# EAGLE board Stromlaufplan_3D-Drucker-Dominik_und_Sami_v5 (EAGLE 9.5.2)
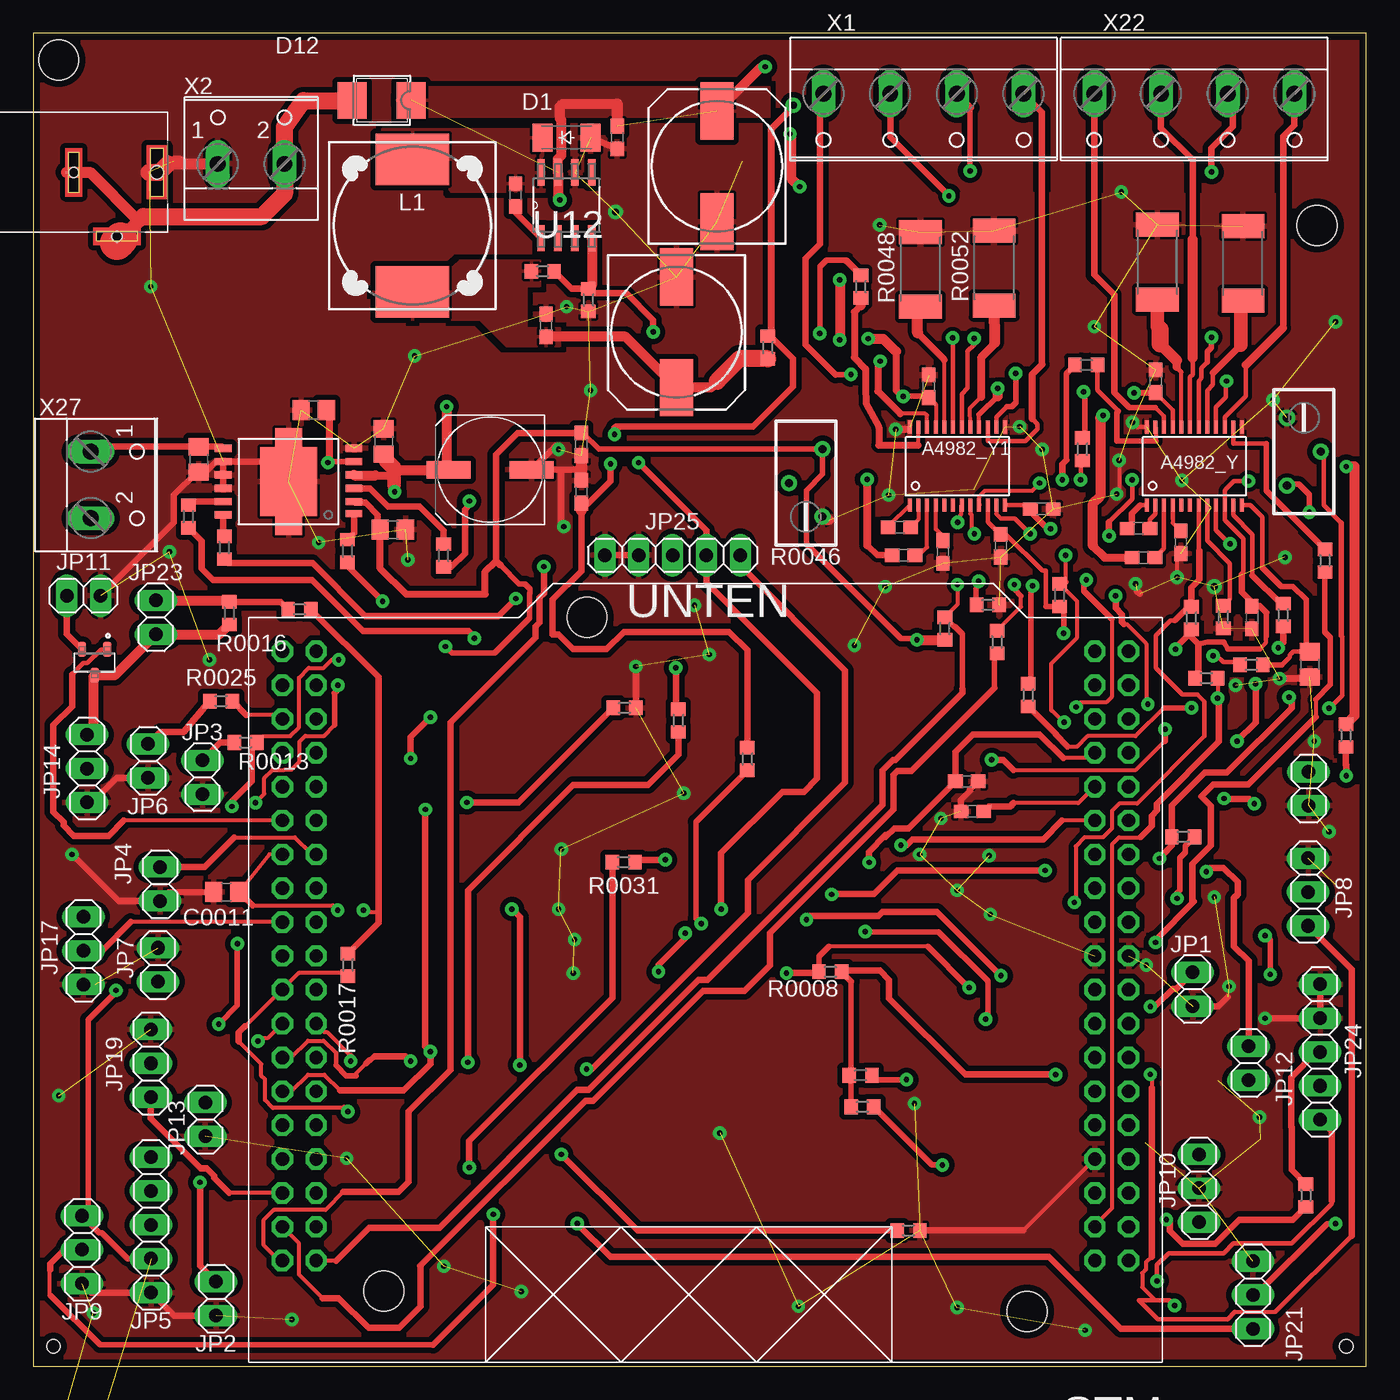
[diagram p5: board, top side]
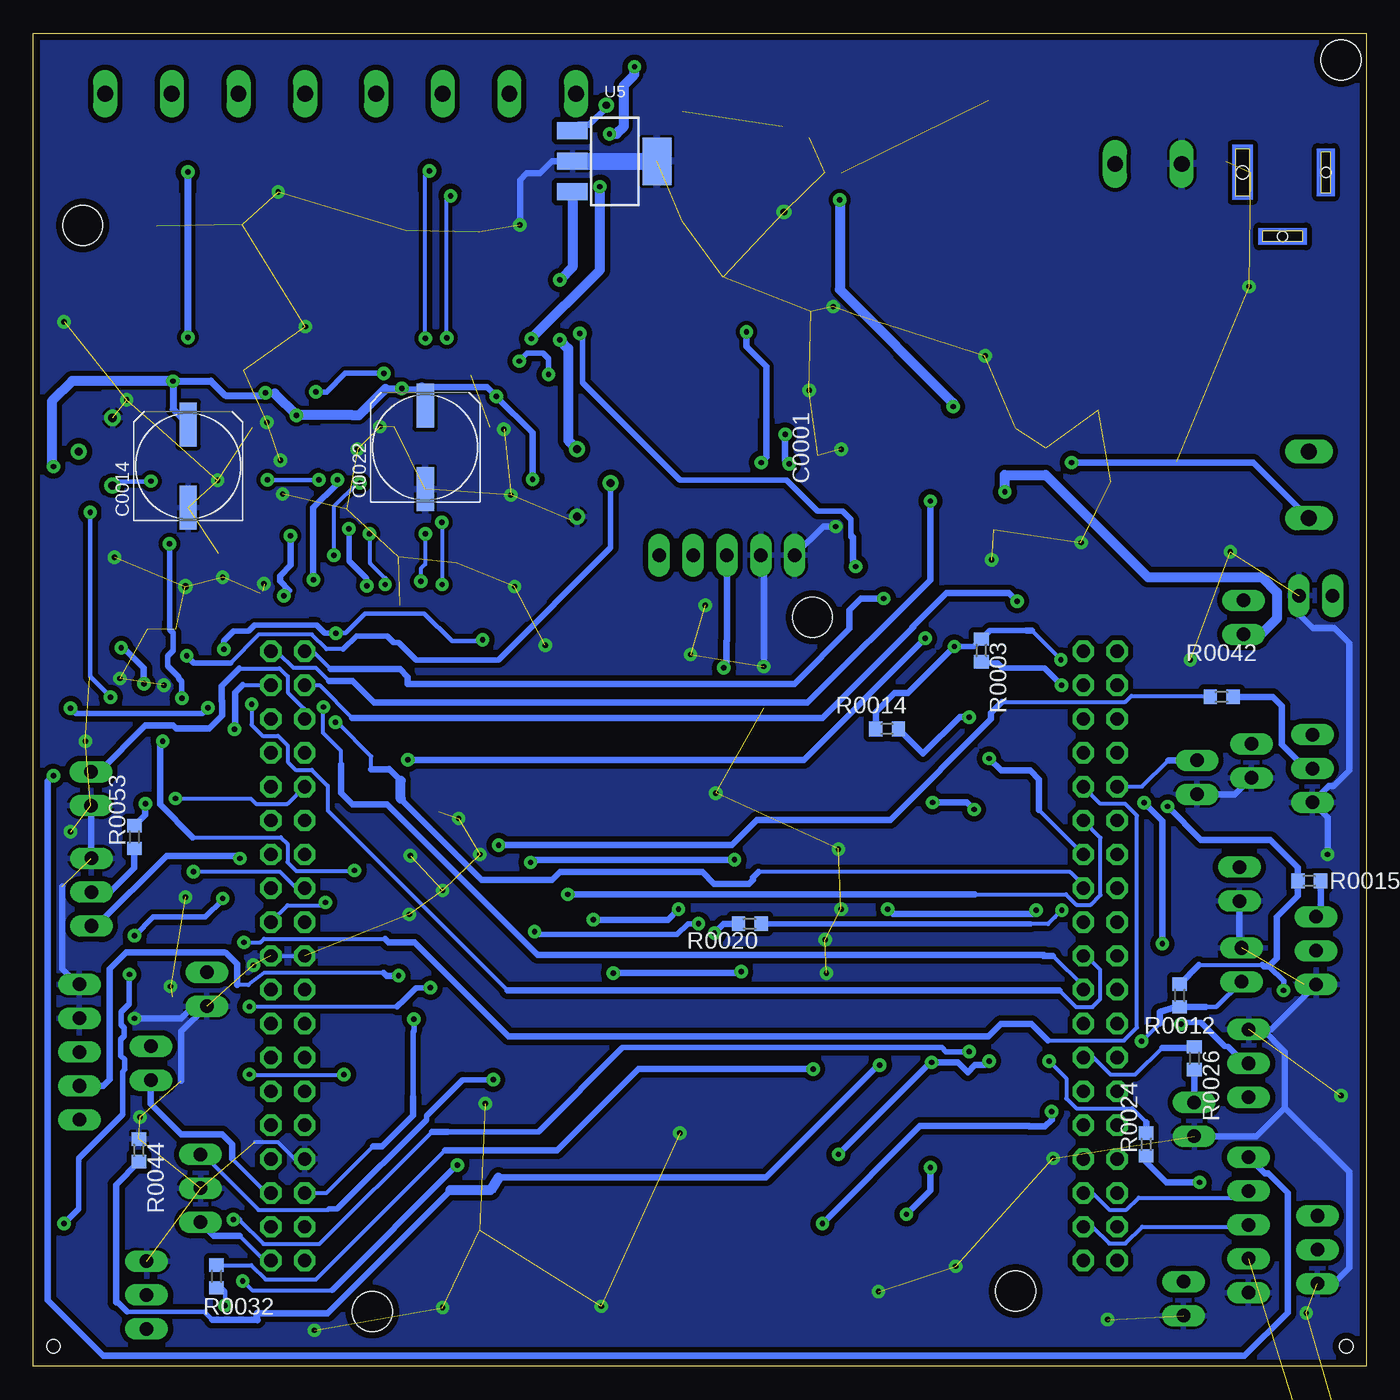
[diagram p6: board, bottom side, seen from below]

Size 100 x 100 mm. Coordinates in mm from the lower left corner, seen from the top.
Outline: 0,0 100,0 100,100 0,100 0,0
Copper layers (1*16): Top 0.035mm / dielectric 1.5mm / Bottom 0.035mm
Design rules "191010_FVM_default": minimum track width 0.3mm, minimum drill 0.4mm, track to track 0.3mm, track to pad 0.3mm, pad to pad 0.3mm, via to via 0.3mm, smd to smd 0.15mm, copper to edge 0.5mm, drill to drill 0.2mm, minimum pad ring 0.3mm, minimum via ring 0.3mm, stop-mask expansion 0.075mm, vias tented up to drill 0mil, thermal gap 0.2mm
Net classes: 0 default: width 0.3 mm, drill 0.4 mm, clearance 0.3 mm; 1 Ground: width 0.3 mm; 2 12V: width 0.3 mm; 3 5V: width 0.3 mm; 4 3,3V: width 0.3 mm
Holes 3 mm at 1.9,98 96.3,85.6
Holes 1 mm at 98.5,1.5 1.5,1.5

## Footprints (pad centres in the part's own frame; a part is rotated, then mirrored left to right if it is on the bottom)
TSSOP24 = smd 0.305 x 0.991: 1 -3.575,-2.918; 2 -2.925,-2.918; 3 -2.275,-2.918; 4 -1.625,-2.918; 5 -0.975,-2.918; 6 -0.325,-2.918; 7 0.325,-2.918; 8 0.975,-2.918; 9 1.625,-2.918; 10 2.275,-2.918; 11 2.925,-2.918; 12 3.575,-2.918; 13 3.575,2.918; 14 2.925,2.918; 15 2.275,2.918; 16 1.625,2.918; 17 0.975,2.918; 18 0.325,2.918; 19 -0.325,2.918; 20 -0.975,2.918; 21 -1.625,2.918; 22 -2.275,2.918; 23 -2.925,2.918; 24 -3.575,2.918
C0603 = smd 1.1 x 1: 1 -0.85,0; 2 0.85,0
C0805 = smd 1.3 x 1.5: 1 -0.95,0; 2 0.95,0
UD-8X10_NICHICON = smd 3.3 x 1.3: + 3.125,0; - -3.125,0
140CLH-1010 = smd 4.3 x 2.5: + 4.15,0; - -4.15,0
SOD-123_MINI-SMA = smd 1.5 x 2.1: A 1.8,0; C -1.8,0
SMB = smd 2.159 x 2.743: 1 -2.311,-0.127; 2 2.108,-0.102
BSOP-12 = smd 1.27 x 0.55: 1 -4.9,2.4; 2 -4.9,1.5; 3 -4.9,0.5; 4 -4.9,-0.5; 5 -4.9,-1.5; 6 -4.9,-2.5; 7 4.9,-2.5; 8 4.9,-1.5; 9 4.9,-0.5; 10 4.9,0.5; 11 4.9,1.5; 12 4.9,2.5 | smd 2 x 8: PAD 0,0 | smd 4.3 x 5.2: PAD2 0,0
SWC_RAPC712X = smd 0.1 x 0.1: 1 0,2.4; 2 5.3,0; 3 0,-3.8 | hole 1.01: 0,3 | hole 0.76: 0,-3.25; 4.8,0
1X02 = drill 1.016 long: 1 -1.27,0; 2 1.27,0
1X05 = drill 1.016 long: 1 -5.08,0; 2 -2.54,0; 3 0,0; 4 2.54,0; 5 5.08,0
1X03 = drill 1.016 long: 1 -2.54,0; 2 0,0; 3 2.54,0
INDUCTOR = smd 3.85 x 5.5: 1 -4.975,0; 2 4.975,0
SOT23-3 = smd 0.62 x 1.1: 1 -0.95,-0.975; 2 0.95,-0.975; 3 0,0.975
R0603 = smd 1 x 1.1: 1 -0.85,0; 2 0.85,0
RTRIM3296Y = drill 0.61: 1 1.27,-2.54; 2 -1.27,0; 3 1.27,2.54
R2512 = smd 1.8 x 3.2: 1 -2.8,0; 2 2.8,0
DIL40 = drill 1 octagon: L1 0,-63.5; L2 0,-60.96; L3 2.54,-63.5; L4 2.54,-60.96; L5 5.08,-63.5; L6 5.08,-60.96; L7 7.62,-63.5; L8 7.62,-60.96; L9 10.16,-63.5; L10 10.16,-60.96; L11 12.7,-63.5; L12 12.7,-60.96; L13 15.24,-63.5; L14 15.24,-60.96; L15 17.78,-63.5; L16 17.78,-60.96; L17 20.32,-63.5; L18 20.32,-60.96; L19 22.86,-63.5; L20 22.86,-60.96; L21 25.4,-63.5; L22 25.4,-60.96; L23 27.94,-63.5; L24 27.94,-60.96; L25 30.48,-63.5; L26 30.48,-60.96; L27 33.02,-63.5; L28 33.02,-60.96; L29 35.56,-63.5; L30 35.56,-60.96; L31 38.1,-63.5; L32 38.1,-60.96; L33 40.64,-63.5; L34 40.64,-60.96; L35 43.18,-63.5; L36 43.18,-60.96; L37 45.72,-63.5; L38 45.72,-60.96; R1 0,-2.54; R2 0,0; R3 2.54,-2.54; R4 2.54,0; R5 5.08,-2.54; R6 5.08,0; R7 7.62,-2.54; R8 7.62,0; R9 10.16,-2.54; R10 10.16,0; R11 12.7,-2.54; R12 12.7,0; R13 15.24,-2.54; R14 15.24,0; R15 17.78,-2.54; R16 17.78,0; R17 20.32,-2.54; R18 20.32,0; R19 22.86,-2.54; R20 22.86,0; R21 25.4,-2.54; R22 25.4,0; R23 27.94,-2.54; R24 27.94,0; R25 30.48,-2.54; R26 30.48,0; R27 33.02,-2.54; R28 33.02,0; R29 35.56,-2.54; R30 35.56,0; R31 38.1,-2.54; R32 38.1,0; R33 40.64,-2.54; R34 40.64,0; R35 43.18,-2.54; R36 43.18,0; R37 45.72,-2.54; R38 45.72,0 | hole 3: -3.81,-55.88; 48.26,-22.86; -2.29,-7.62
SOT-223 = smd 1.27 x 2.286: 1 -2.286,-3.175; 2 0,-3.175; 3 2.286,-3.175 | smd 3.556 x 2.159: TER 0,3.175
SOIC-8 = smd 1.981 x 0.559: 1 -2.464,1.905; 2 -2.464,0.635; 3 -2.464,-0.635; 4 -2.464,-1.905; 5 2.464,-1.905; 6 2.464,-0.635; 7 2.464,0.635; 8 2.464,1.905
W237-4 = drill 1.194 long: 1 -7.5,-1.27; 2 -2.5,-1.27; 3 2.5,-1.27; 4 7.5,-1.27
W237-102 = drill 1.194 long: 1 -2.5,-1.27; 2 2.5,-1.27

## Placement (x,y rotation side)
A4982_Y  A4982_STEPDRIVER  [TSSOP24]  87.11,67.53 0 top
A4982_Y1  A4982_STEPDRIVER  [TSSOP24]  69.33,67.53 0 top
C0001  0,33µF  [C0603]  41.12,65.61 270 top
C0002  0,1 µF  [C0603]  82.92,62.85 0 top
C0003  10nF  [C0603]  36.19,87.86 90 top
C0004  0,22µF  [C0603]  86.09,61.82 270 top
C0005  0,22µF  [C0603]  91.42,56.17 270 top
C0006  100nF  [C0603]  83.29,60.66 180 top
C0007  33nF  [C0805]  21.04,71.73 180 top
C0008  33nF  [C0805]  12.41,68.03 270 top
C0009  100µF  [UD-8X10_NICHICON]  34.26,67.26 180 top
C0010  0,47 µ  [C0805]  95.77,52.66 270 top
C0011  [C0805]  14.48,35.57 180 top
C0012  0,1µF  [C0603]  41.12,69.16 90 top
C0013  0,47 µF  [C0603]  75.65,64.31 0 top
C0014  100µF  [UD-8X10_NICHICON]  88.38,67.53 90 bottom
C0015  100nF  [C0603]  43.81,92.18 90 top
C0016  100nF  [C0805]  26.97,62.76 0 top
C0018  0,1 µF  [C0603]  64.98,62.93 0 top
C0019  0,22µF  [C0603]  68.24,61.1 270 top
C0020  0,22µF  [C0603]  72.59,61.56 270 top
C0021  100nF  [C0603]  65.29,60.84 180 top
C0022  100µF  [UD-8X10_NICHICON]  70.6,68.93 90 bottom
C0023  10nF  [C0603]  38.47,78.08 90 top
C0024  0,1µF  [C0603]  70.03,43.88 180 top
C0025  0,1µF  [C0603]  70.45,41.62 0 top
C0026  100nF  [C0603]  84.2,73.89 270 top
C0027  100nF  [C0603]  67.18,73.52 90 top
C0041  100nF  [C0805]  26.29,69.39 90 top
CIN1  100µF  [140CLH-1010]  51.29,90.02 90 top
COUT1  68µF  [140CLH-1010]  48.25,77.57 270 top
D1  1N5819HW-7-F  [SOD-123_MINI-SMA]  40,92.18 0 top
D12  MURS360BT3G  [SMB]  26.03,94.84 180 top
H_X  IFX9201SG  [BSOP-12]  19.15,66.37 180 top
J1  RAPC712X  [SWC_RAPC712X]  6.28,89.57 270 top
JP1  [1X02]  86.99,28.28 270 top
JP2  [1X02]  13.71,5.07 90 top
JP3  [1X02]  12.69,44.18 270 top
JP4  [1X02]  9.51,36.17 90 top
JP5  [1X05]  8.84,10.6 270 top
JP6  [1X02]  8.61,45.42 90 top
JP7  [1X02]  9.35,30.11 90 top
JP8  [1X03]  95.64,35.57 270 top
JP9  [1X03]  3.66,8.74 90 top
JP10  [1X03]  87.46,13.35 90 top
JP11  [1X02]  3.78,57.81 180 top
JP12  [1X02]  91.19,22.73 270 top
JP13  [1X02]  12.91,18.52 90 top
JP14  [1X03]  4.04,44.84 270 top
JP15  [1X02]  95.69,43.33 270 top
JP17  [1X03]  3.76,31.17 90 top
JP18  [1X02]  -2.12,-23.18 0 top  (outside the outline)
JP19  [1X03]  8.81,22.72 90 top
JP21  [1X03]  91.51,5.34 90 top
JP23  [1X02]  9.19,56.18 270 top
JP24  [1X05]  96.54,23.57 270 top
JP25  [1X05]  47.96,60.84 0 top
L1  47µ/H  [INDUCTOR]  28.44,85.57 270 top
Q1  2N7002,215  [SOT23-3]  4.6,52.8 180 top
R0001  1,5K  [R0603]  30.78,60.83 90 top
R0002  6,8k  [R0603]  95.47,12.81 90 top
R0003  1k  [R0603]  28.87,53.71 270 bottom
R0004  2,7k  [R0603]  44.35,49.39 180 top
R0005  6,8k  [R0603]  48.39,48.43 90 top
R0006  25k  [R0603]  89.28,56.21 90 top
R0007  10 k  [R0603]  -3.75,-27.41 0 top  (outside the outline)
R0008  [R0603]  59.79,29.59 180 top
R0009  1,2 k  [R0603]  78.99,75.12 0 top
R0010  1,2 k  [R0603]  93.78,56.37 90 top
R0011  1,2 k  [R0603]  96.9,60.43 270 top
R0012  1 k  [R0603]  13.99,27.81 270 bottom
R0013  1k  [R0603]  15.93,46.79 180 top
R0014  [R0603]  35.95,47.81 0 bottom
R0015  1 k  [R0603]  4.27,36.41 0 bottom
R0016  [R0603]  14.7,56.5 270 top
R0017  [R0603]  23.61,30.11 270 top
R0018  frei lassen  [R0603]  86.27,39.71 0 top
R0019  25k  [R0603]  71.62,57.12 180 top
R0020  [R0603]  46.25,33.19 180 bottom
R0021  1,2 k  [R0603]  86.88,56.13 90 top
R0022  1,2 k  [R0603]  88.01,51.62 0 top
R0023  470  [R0603]  91.39,52.62 0 top
R0024  68  [R0603]  16.51,16.63 90 bottom
R0025  68  [R0603]  14.09,49.89 180 top
R0026  100  [R0603]  12.89,23.11 270 bottom
R0027  [R0603]  53.57,45.56 270 top
R0028  2,7k  [R0603]  65.67,10.18 180 top
R0029  82  [R0603]  62.21,19.46 180 top
R0030  [R0603]  98.48,47.31 90 top
R0031  [R0603]  44.29,37.82 0 top
R0032  82  [R0603]  86.26,6.73 270 bottom
R0033  1 k  [R0603]  62.07,21.82 0 top
R0034  1,2 k  [R0603]  62.09,80.99 270 top
R0035  1,2 k  [R0603]  72.3,54.33 90 top
R0036  1,2 k  [R0603]  78.7,68.79 270 top
R0037  470  [R0603]  74.64,50.34 90 top
R0038  4,7 K  [R0603]  68.39,55.34 90 top
R0039  4,7 K  [R0603]  77,57.85 90 top
R0042  1,2k  [R0603]  10.85,50.22 0 bottom
R0043  6,8k  [R0603]  19.97,56.78 180 top
R0044  2,7k  [R0603]  92.08,16.19 270 bottom
R0045  5 k  [RTRIM3296Y]  95.33,68.61 180 top
R0046  [RTRIM3296Y]  57.95,66.27 0 top
R0048  0,2  [R2512]  66.55,82.29 90 top
R0049  0,2  [R2512]  90.75,82.73 90 top
R0051  0,2  [R2512]  84.33,82.83 90 top
R0052  0,2  [R2512]  72.09,82.38 90 top
R0053  [R0603]  92.42,39.69 90 bottom
R0061  1,5k  [R0603]  23.57,61.17 90 top
R0062  1,5k  [R0603]  14.33,61.41 90 top
R0063  1,5K  [R0603]  11.63,63.76 90 top
STM  NUCLEOF303RE  [DIL40]  18.68,7.92 90 top
TEST_R  0  [R0603]  55.11,76.43 90 top
TEST_R2  3,3k  [R0603]  38.22,82.14 180 top
TEST_R3  1k  [R0603]  41.65,79.99 270 top
U5  UA78M33  [SOT-223]  56.38,90.4 270 bottom
U12  LM2672MX-ADJ/NOPB  [SOIC-8]  40,87.1 90 top
X1  [W237-4]  66.79,94.2 180 top
X2  [W237-102]  16.34,91.47 0 top
X22  [W237-4]  87.11,94.2 180 top
X27  [W237-102]  5.57,66.12 270 top

## Tracks (layer width: path | path; a pad name or v marks a point on that pad's centre or on a via)
3,3V  (via drill 0.4)  (1 unrouted)
  Top 0.3: R0013.1 17.27,47.28 19.28,47.28 19.93,47.93 19.93,51.64 20.67,52.38 21.78,52.38 22.41,53.01 v22.91,53.01 | 84.17,4.95 83.2,5.92 83.2,6.98 83.48,7.26 83.48,7.8 83.9,8.22 | 90.15,4.07 93.17,4.07 | 83.83,21.87 v83.8,21.9 83.9,21.8 83.9,20.9 | 92.48,54.62 92.48,54.33 92.45,54.29 92.45,54.25 92,53.8
  Top 0.34: A4982_Y1.10 71.62,63.34 72.54,62.41 C0020.1 72.99,62.41 75.7,59.7 75.95,59.7 75.95,57 | 90.67,59.4 90.77,59.5 90.77,62.1 89.39,63.48 A4982_Y.10 89.39,64.62 89.39,65.69 89.49,65.78 89.49,65.81 90.09,66.41 v91.19,66.41 | 93.17,4.07 98.9,9.8 | v85.62,4.56 85.23,4.95 84.17,4.95 82.95,4.95 84.38,3.52 89.6,3.52 90.15,4.07 | 92.5,54.8 92.48,54.78 92.48,54.62 92.48,54.48
  Top 0.406: R0045.3 94.16,66.17 94.96,66.17 95.73,65.4 v95.73,64.06 | v85.7,53.8 85.7,53.92 86.88,55.1 | v66.29,54.49 66.19,54.59 65.11,54.59 58,61.7 58,65.7 59.22,66.92 R0046.3 42.42,68.81 41.22,70.01 C0012.2 | JP5.4 7.09,8.06 5.15,10.01 4.93,10.01 JP9.3 4.1,11.72 4.1,26 6.2,28.1 v6.2,28.2 | 35.03,60.13 36.46,58.7 36.9,58.7 37.28,58.32 37.28,58.02 37.22,57.97 37.22,56.12 34.6,53.5 31.4,53.5 v30.9,54 | R0029.2 61.36,21.68 R0033.1 61.36,21.96 61.36,28.87 | v77.3,55 77.3,56.7 R0039.1 75.95,57 | 92.5,56.54 92.5,54.8 | 87.4,54.2 88.12,54.32 89.3,54.32 89.6,53.8 92,53.8
  Top 0.47: 92.5,56.54 92.02,57.02 C0005.1 | R0021.1 86.88,55.1 86.88,54.72 87.4,54.2 87.4,51.86 R0022.1
  Top 0.5: C0005.1 91.42,57.32 90.67,58.07 90.67,59.4 | H_X.2 24.12,64.8 24.91,64.8 25.84,63.87 25.84,62.59 | C0012.2 36.31,70.01 34.7,68.4 34.7,60.42 | v94.2,50.2 94.4,50 94.4,49.4 89.55,44.55 87.9,44.55 85.42,42.07 R0018.1 85.4,39.69 85.4,39.05 85.05,38.7 85.05,38.65 v84.5,38.1 | JP8.3 98.9,29.77 98.9,9.8 | 83.9,8.22 83.9,20.9 | R0013.1 16.38,46.39 16.38,43.88 14.9,42.4 v14.9,42 | v76.7,21.88 69.92,21.88 64.2,27.6 64.2,29 63.5,29.7 60.75,29.7 R0008.1 61.36,28.87
  Top 0.508: 25.84,62.59 25.85,62.59 C0016.1 26,62.74 26,59.9 28,57.9 33.9,57.9 33.9,59.62 34.7,60.42 34.99,60.13 35.03,60.13
  Top 0.75: v60.5,81.5 v60.5,77 | v66.29,54.49 R0038.1
  Bottom 0.3: v22.91,53.01 25.1,55.2 | v83.8,21.9 83.77,21.87 v76.7,21.87
  Bottom 0.305: 12.55,30.1 7.79,30.1
  Bottom 0.34: R0045.3 94.06,66.29 93.96,66.39 91.2,66.39 v91.19,66.41 | v95.73,64.06 95.73,51.73 v94.2,50.2 | v66.29,54.49 66.38,54.4 68.6,54.4 70.67,56.47 75.1,56.47 76.57,55 v77.3,55 | v85.62,4.56 85.62,5.62 86.07,6.07
  Bottom 0.406: v85.7,53.8 85.7,54.4 84.95,55.15 83.85,55.15 83.4,55.6 78.73,55.6 78.14,55 v77.3,55 | v6.2,28.2 6.2,28.9 7.3,30 | 25.5,55.2 28.23,55.2 R0003.1 29.43,54 v30.9,54
  Bottom 0.5: 25.1,55.2 25.5,55.2 | JP8.3 95.27,33.03 90,38.3 84.7,38.3 v84.5,38.1 | 86.07,6.07 R0032.2 | 7.79,30.1 7.69,30 7.3,30 6.7,30.6 6.7,33.7 5.12,35.28 R0015.1 5.12,37.42 7.2,39.5 12.4,39.5 v14.9,42 | R0012.1 12.55,30.1 | v30.9,54 34.4,50.5 35.4,50.5 36.8,49.1 R0014.1 | v76.7,21.88 v76.7,21.87
  Bottom 0.75: U5.3 59.55,82.44 v60.5,81.5 | v60.5,77 60.5,76.98 59.87,76.35 59.87,69.46 R0046.3
12V  (via drill 0.4)  (2 unrouted)
  Top 0.3: C0027.1 67.23,72.67 67.3,72.6
  Top 0.305: A4982_Y1.21 67.7,72.19 67.3,72.6 | A4982_Y1.16 70.95,71.38 | 85.48,71.75 84.22,73.02
  Top 0.34: 67.3,72.6 67.13,72.77 | A4982_Y.16 88.73,71.95 89.48,72.69 89.48,73.86 v89.52,73.91 | 85.48,71.75 A4982_Y.21
  Top 0.406: v65.27,72.77 67.13,72.77 | 70.95,71.38 72.35,72.78 | C0026.2 82.61,73.04 v82.59,73.02 84.22,73.02
  Top 0.5: C0021.2 63.31,60.84 62.58,61.58 | 62.58,66.57 v62.55,66.54
  Top 0.508: 64.72,76.12 64.72,73.22 65.22,72.72 v65.27,72.77
  Top 0.61: 62.58,61.58 62.58,66.57 | C0006.2 80.39,60.66 79.51,61.54 | 25.66,66.82 27.05,66.82 27.05,67
  Top 0.75: 64.72,76.12 63.78,77.07 62.65,77.07 v62.65,77.1 | v57.5,88.5 56.86,89.14 56.86,92.37 v56.77,92.46 | v54.9,97.5 54.9,97.38 54.5,97.38 CIN1.+ | 43.81,94.72 39.72,94.72 39.5,94.5 39.5,93.63 39.62,93.51 39.62,90.85 39.36,90.59 U12.7 39.36,87.64 v39.5,87.5 | v31,72 31,67.4 C0009.+ 31.08,67.2 26.92,67.2 26.29,67.84 26.29,68.3 C0041.1 27.05,67.68 27.05,67 27.05,66 27.11,65.94 v27.11,65.59 27.11,66.07 27.09,66.1 | R0030.2 99.11,48.79 99.11,67.5 v98.5,67.5 | R0016.2 13.96,54.91 JP23.2 6.11,51.83 Q1.3 4.5,51.73 4.5,47.84 JP14.1 | 25.66,66.82 24.1,66.82 H_X.4 | 79.51,61.54 79.51,64.71 80.05,65.25 80.05,71.14 v80.25,71.34 | 72.35,72.78 v72.35,73.37
  Top 0.813: 43.81,94.72 C0015.2
  Top 1.016: 26.29,68.3 27.09,67.5 27.09,66.1
  Bottom 0.406: v82.59,73.02 82.59,72.98
  Bottom 0.5: v62.55,66.54 62.55,70.04 v65.27,72.76 v65.27,72.77 65.95,73.45 70.83,73.45 | 70.83,73.25 72.23,73.25 72.33,73.35 v72.35,73.37
  Bottom 0.508: 81.89,72.98 82.59,72.98 | v82.59,73.02 82.79,72.82 85.6,72.82 86.69,73.91 v89.52,73.91 89.52,71.8 C0014.+
  Bottom 0.61: 73.6,73.32 72.42,73.32
  Bottom 0.75: v62.65,77.1 57.5,82.25 v57.5,88.5 | v56.77,92.46 56.24,92.46 55.7,93 55.7,96.1 54.9,96.9 v54.9,97.5 | 73.6,73.32 75.57,71.35 76.04,71.34 v80.25,71.34 81.89,72.98 | v39.5,87.5 39.5,80.77 31,72.27 v31,72 | v89.52,73.91 97.09,73.91 98.61,72.39 98.61,67.61 v98.5,67.5 | JP23.2 7.89,54.91 6.7,56.1 6.7,58.05 7.85,59.2 16.38,59.2 H_X.4 27.11,66.87 v27.11,65.59 | 70.83,73.45 70.83,73.25 70.83,72.25 C0022.+ | 72.42,73.32 72.37,73.32 72.33,73.35
  pour Top: 55.24,93.7 27.3,93.7 27.3,95.99 55.24,95.99
+5V  (via drill 0.4, 0.55)
  Top 0.47: 44.3,55.1 43,53.8 40.5,53.8 39.4,54.9
  Top 0.5: TEST_R.2 55.32,77.28 57,75.6 57,73.5 54,70.5 43.7,70.5 43.6,70.4 v43.6,69.9 | v43.3,67.7 43.3,66.4 41.12,64.22 | C0001.2 41.12,59.67 38.97,57.53 38.97,54.9 39.4,54.9 | 44.3,55.1 52.2,55.1 53.57,53.73 R0027.1
  Top 0.508: TEST_R.2 55.38,77.55 55.38,92.84 57.02,94.48 v57.02,94.61
  Top 0.813: 41.12,64.22 C0001.2
  Bottom 0.5: U5.1 59.11,93.13 58.29,93.13 56.91,94.5 v57.02,94.61 | v43.6,69.9 43.6,68 v43.3,67.7
DA-MESSPIN
  Bottom 0.3: 84.55,52.35 81.52,52.35 80.91,51.74 80.91,50.54 79.71,49.34 79.71,48.95 79.64,48.88 STM.L34
  Bottom 0.5: JP15.1 95.05,44.6 91.59,48.05 89.5,48.05 89.3,47.85 86.81,47.85 85.85,48.8 85.85,49.9 85.88,49.92 85.88,51.02 84.55,52.35
DIR1_Z  (via drill 0.4)
  Top 0.3: 81.84,55.68 82.04,55.68 83.5,54.22 83.5,49.79 v83.62,49.67
  Top 0.34: v78.57,66.5 78.57,66.9 78.6,66.93 78.6,67.84 R0036.2 | v82.44,66.49 82.44,65.07 80.71,63.34
  Top 0.47: v81.2,57.8 81.2,56.87 81.69,56.39 81.69,55.83 81.84,55.68
  Top 0.5: 80.71,63.34 v80.71,62.31
  Bottom 0.3: v83.62,49.67 83.63,49.66 83.63,48.12 82.8,47.29 81.64,47.29 80.91,46.55 80.91,45.33 80.33,44.75 79.12,44.75 77.92,43.55 77.92,41.68 64.44,28.2 | 23.01,28.2 21.77,26.96 20.54,26.96 19.95,27.55 19.95,29.75 20.98,30.78 STM.R19
  Bottom 0.34: v82.44,66.49 78.58,66.49 v78.57,66.5
  Bottom 0.47: 80.71,60.09 81.5,59.3 81.5,58.9 80.8,58.2 v81.2,57.8
  Bottom 0.5: 64.44,28.2 23.01,28.2 | 80.71,60.09 v80.71,62.31
DIR2_Y  (via drill 0.4)
  Top 0.305: 96.2,50.02 96.2,48.7
  Top 0.406: R0011.2 96.9,55.09 97.32,54.67 97.32,51.14 96.2,50.02
  Top 0.5: 96.2,48.7 91.15,43.65 88.55,43.65 87.62,42.73 88.33,42.03 88.33,39.07 86.95,37.7 86.95,34.95 87.05,34.85 84.2,32 v84.2,31.8
  Bottom 0.3: v84.2,31.8 82.96,31.8 82.7,32.06 73.62,32.06 | 23.88,24.44 18.16,24.44 17.2,25.4 17.2,41.31 18.09,42.2 19.94,42.2 STM.R29
  Bottom 0.5: 73.62,32.06 73.36,31.8 71.4,31.8 64.35,24.75 28.34,24.75 27.42,25.67 25.12,25.67 23.88,24.44
DIR-H  (via drill 0.4)
  Top 0.47: v26.2,57.4 25.31,58.29 25.3,58.29 23.57,60.02 R0061.1
  Bottom 0.3: STM.L36 78.52,51.1 76.07,48.65
  Bottom 0.47: 76.07,48.65 40.78,48.65 33.98,55.44 34.06,55.44 31.5,58 26.8,58 v26.2,57.4
DIS-H  (via drill 0.4)
  Top 0.3: 84.9,46.9 82.74,44.74 73.53,44.74
  Top 0.47: R0063.1 12.64,61.9 12.64,59.84 13.48,59 20.91,59 24.75,55.16 32.64,55.16 33.09,54.7 v33.09,54.6
  Top 0.5: v71.9,45.5 72.77,45.5 73.53,44.74 | 84.9,46.9 v84.9,47.8
  Bottom 0.3: 84.3,51.1 STM.L35
  Bottom 0.5: v33.09,54.6 42.2,45.5 v71.9,45.5 | v84.9,47.8 84.85,47.85 84.85,50.55 84.3,51.1
ENA1_Z  (via drill 0.4)
  Top 0.3: 23.26,13.07 21.91,11.72 18.04,11.72 17.25,10.93 17.25,9.11 18.56,7.8 STM.R2
  Top 0.406: 61,82.93 61,83 59.5,83 59,82.5 v59,77.5
  Top 0.5: v38.3,60 38.3,57.98 37.97,57.66 37.97,55.81 37.67,55.51 37.67,54.67 31.29,48.29 31.29,22.23 28.16,19.1 28.16,13.81 27.41,13.07 23.26,13.07
  Top 0.508: R0034.1 61,82.93
  Bottom 0.406: v59,77.5 58.8,77.3 58.8,73.8 51.5,66.5 43.5,66.5 41.15,64.15 39.29,64.15 38.65,63.51 38.65,62.19 38.57,62.27 38.5,62.2
  Bottom 0.5: v38.3,60 38.3,60.2 38.5,60.4 38.5,62.2
ENA2_Y  (via drill 0.4)
  Top 0.3: 80.9,56.06 80.91,56.05 80.91,50.22 80.5,49.81 78.59,49.81 v78.24,49.46
  Top 0.406: R0009.1 77.5,74.48 77.5,68 | 80.9,56.06 78.8,58.16 78.8,58.8 v79,59
  Top 0.47: 77.5,68 77.2,67.7 v77.2,66.5
  Bottom 0.3: STM.R17 21.22,28.52 23.5,30.8 | 76.92,45.13 76.92,46.17 78.28,47.53 78.28,49.42 v78.24,49.46
  Bottom 0.47: v77.2,66.5 77.2,66.2 79,64.4 v79,59
  Bottom 0.5: 23.5,30.8 24.23,30.8 24.19,30.85 62.15,30.85 73.46,42.16 76.05,42.16 76.92,43.02 76.92,45.13
ENDLAGE_Y
  Top 0.3: STM.R6 14.7,13
  Top 0.5: JP19.1 8.81,18.59 12.55,14.85 12.99,14.85 13.55,14.29 13.55,14.15 14.7,13
ENDLAGE_Z
  Top 0.3: STM.R22 7.32,33.32
  Top 0.5: JP17.2 5.17,31.17 7.32,33.32
EXTRA1
  Bottom 0.3: 84.51,9.8 82.63,7.92 STM.L1
  Bottom 0.5: JP10.1 86.45,9.8 84.51,9.8
GND  (via drill 0.4, 0.5)  (101 unrouted)
  Top 0.3: STM.L8 74.28,10.18 | A4982_Y.24 82.83,70.45 v82.47,70.81 | v81.47,67.96 81.47,65.61 v81.29,65.43 | C0004.2 arc90 85.8,60.68 v85.8,59.2
  Top 0.305: A4982_Y1.24 65.66,70.35
  Top 0.406: 65.66,70.35 65.66,70.3
  Top 0.5: C0015.1 D1.A | 39.6,67.26 C0009.- 39.16,69.03 v39.4,68.8 | 39.6,67.26 40.74,67.26 41.12,67.64 | H_X.8 13.7,67.87 12.91,67.08 C0008.2 12.28,67.08 10.53,65.34 10.53,63.29 JP11.1 | H_X.8 17.83,67.87 19.15,66.55 H_X.PAD2 | H_X.8 H_X.10 H_X.9 | JP25.2 JP25.1 | JP6.1 6.25,44.15 4.22,42.12 JP14.3 | JP24.1 JP24.2 v92.41,26.11 v92.4,26.1 | JP1.2 88.91,27.01 89.6,27.7 | C0011.2 10.14,35.53 JP4.1 6.4,34.9 v2.9,38.4 | JP2.1 10.56,3.8 JP5.5 4.34,5.52 JP9.1 | 4.66,28.63 JP17.1 | v39.8,63 39.6,63.2 39.6,67.26 | R0004.1 v45.2,52.5 | 74.28,10.18 R0028.1 | C0024.1 70.28,43.28 70.28,43.15 69.6,42.47 C0025.1 | 82.8,58.16 83,57.96 | C0010.2 95.66,51.6 v93.5,51.6
  Top 0.508: v64.7,70.3 65.66,70.3
  Top 0.75: R0046.1 59.45,63.5 59.7,63.5
  Top 0.813: 11,90.4 10.54,90.4 | 41.12,67.64 C0001.1 | 10.11,90.2 X2.1
  Top 1.27: 10.11,90.2 9.48,89.57 J1.1
  Bottom 0.3: STM.L19 STM.L20 | STM.L8 80.38,15.54 81.63,16.79 83.38,16.79
  Bottom 0.5: v63.49,85.62 v63.5,85.63 63.5,89 63,89.5 62,89.5 61.1,90.4 U5.2 | JP8.1 95.64,42.01 JP15.2 | 97.82,36 97.82,29.82 96.65,28.65 JP24.1 | v92.4,26.1 88.9,26.1 87.99,27.01 JP1.2 87.01,27.01 88.89,25.12 88.89,21.42 | JP19.3 7.76,25.26 | 7.76,25.26 7.13,25.26 JP17.1 | JP3.2 9.85,42.91 JP6.1 | JP4.1 9.51,31.54 JP7.2 | JP13.1 8.25,17.25 6.1,19.4 | 6.1,19.4 6.1,23.6 7.76,25.26 | 6.1,19.4 1.27,14.57 1.27,7.4 2.47,6.2 JP9.1 | v2.9,38.4 2.9,41.16 JP14.3 2.81,43.53 2.44,43.53 1.27,44.7 1.27,54.27 2.4,55.4 4,55.4 4.9,56.3 4.9,57.66 JP11.1 | JP25.1 40.72,63 v39.8,63 | v45.2,52.5 45.2,60.62 JP25.2
  Bottom 0.75: U5.2 58.92,90.4
  Bottom 1.27: 58.92,90.4 U5.TER
  other vias: 43.68,86.59 74,70.5 79.6,78 81.63,88.1 97.69,78.36 93,72.5 75.68,68.8 40,79.5 63.9,58.5 97.2,40.1 92,18.7 68.1,41.1 71.8,33.9 71.7,38.3 90.2,51.1 93.9,60.7 1.9,20.3 4.5,4 19.4,3.5 23.5,15.6 36.6,5.6 57.4,4.5 69.3,4.4 51.5,17.5 40.5,29.5 39.6,38.8 40.6,32 39.4,34.3 48.8,43 61.6,54.1 96.1,46.9 49.6,57.1 41.8,73.2 28.6,75.8 8.8,81 66.1,19.7 78.9,2.7 13.2,53 30.8,7.5 88.6,58.5 82.7,58.7 69.3,35.7 50.7,53.4 88.6,35.2 66.5,38.4 89.7,28.5 83.5,30.1 28.1,60.5 21.4,61.8 10.2,61.1 64.17,65.36 86.17,66.46
  pour Top: 40,89.64 40,93.19 42.54,93.19 42.54,91.8 47.87,91.8 47.87,91.03 52.06,91.03 51.94,79.1 43.17,79.21 43.17,81.89 43.3,90.4 44.82,90.4 44.82,91.16 41.27,91.16 41.27,89.64
  pour Top: 40,89.64 40,93.19 42.54,93.19 42.54,91.8 44.82,91.8 44.82,90.15 42.79,90.15 42.79,91.03 41.01,91.03 41.01,89.64
  pour Top: 38.09,79.86 38.09,78.46 42.79,78.46 43.55,79.22 43.55,79.99 38.22,79.99
  pour Bottom: 10.66,96.75 10.66,86.59 11.93,85.32 19.55,85.32 20.82,84.05 20.82,78.97 22.09,78.97 23.36,77.7 33.52,77.7 36.06,75.16 41.14,75.16 42.41,73.89 42.41,72.62 43.68,71.35 52.57,71.35 55.11,73.89 55.11,80.24 56.38,81.51 56.38,95.48 55.11,96.75
  pour Top: 61.71,56.1 61.71,87.85 78.22,87.85 78.22,56.1
  pour Bottom: 61.71,56.1 78.22,56.1 78.22,87.85 64.25,87.85 64.25,77.69 65.52,76.42 65.52,75.15 61.71,71.34
  pour Top: 79.49,56.1 79.49,87.85 94.73,87.85 94.73,56.1
  pour Bottom: 79.49,56.1 94.73,56.1 94.73,87.85 79.49,87.85
  pour Bottom (isolate 0.4, rank 2): 100.1,-0.1 100.1,99.9 0.1,99.9 0,99.8 0,0 -0.1,-0.1
  pour Top (isolate 0.4, rank 2): 100,-0.4 100,99.9 99.9,100 0.2,100 0,99.8 0,0 0.1,-0.1 0.3,-0.3 99.9,-0.3
HEIZUNG
  Top 0.3: STM.R28 6.8,40.94
  Top 0.34: 2.9,51.9 3.75,52.76 4.06,52.76 5.08,53.77 Q1.1
  Top 0.5: 6.8,40.94 5.64,39.79 3.04,39.79 2.27,40.56 2.27,40.83 1.5,41.6 1.5,48.1 2.9,49.5 2.9,51.9
LASER  (via drill 0.4)
  Top 0.3: STM.L28 77.17,40.94
  Top 0.5: 77.17,40.94 75.77,39.54 65.97,39.54 65.53,39.1 v65.1,39.1
  Bottom 0.3: 27.34,49.84 18.08,49.84 17.62,50.3 11.78,50.3
  Bottom 0.5: v65.1,39.1 47.6,39.1 45.7,41 35.7,41 28.16,48.54 28.16,49.02 27.34,49.84 | 11.78,50.3 R0042.1
LED-GELB  (via drill 0.4)
  Top 0.3: STM.R15 21.86,25.06 22.03,25.06 23.8,23.29
  Top 0.5: 23.8,23.29 v23.8,22.9
  Bottom 0.3: v23.8,22.9 22.49,21.59 22.49,20.09 21.76,19.36 17.56,19.36 16.51,18.31
  Bottom 0.5: 16.51,18.31 R0024.2
LED-GRüN
  Top 0.3: STM.R34 18.38,48.86 15.97,48.86
  Top 0.5: 15.97,48.86 R0025.1
LED-ROT
  Bottom 0.3: STM.R13 20.46,23.16 19.18,21.88 17.32,21.88 15.3,23.9
  Bottom 0.5: R0026.1 12.95,23.9 15.3,23.9
LICHTSCHRANKE_LINKS_X  (via drill 0.4)
  Top 0.3: STM.R14 19.34,23.16 20.6,24.42 21.78,24.42 22.7,23.5
  Top 0.305: 24.23,21.8 24.23,21.98 24.93,22.68
  Top 0.34: 22.7,23.5 22.7,22.57
  Top 0.406: 22.7,22.57 23.47,21.8 24.23,21.8 | 25.59,23.26 25.32,22.99 25.24,22.99 24.93,22.68
  Top 0.5: v28.3,22.9 27.94,23.26 25.59,23.26 | v32.6,22.8 32.6,35.7 40.5,43.6 46.1,43.6 48.4,45.9 R0005.1 | R0028.2 45.32,10.18 v39.6,15.9
  Bottom 0.5: v39.6,15.9 32.7,22.8 v32.6,22.8 30.65,22.8 29.9,22.05 29.35,22.6 28.6,22.6 v28.3,22.9
LICHTSCHRANKE_RECHTS_X  (via drill 0.4)
  Top 0.3: STM.R12 19.36,20.62 20.61,21.87 21.83,21.87 23.02,20.69
  Top 0.5: 23.02,20.69 27.79,20.69 29.8,22.7 v29.8,23.6 29.4,24 29.4,41.76 v29.41,41.77 v29.42,41.77 | R0002.1 94.51,11 90.47,11 88.67,9.2 86.25,9.2 85.29,10.17 85.29,10.71 v85,11 | R0004.2 36.4,42.29 v32.53,42.29
  Bottom 0.3: 84.55,11 82.73,9.18 78.52,9.18 70.1,17.6
  Bottom 0.406: 68.9,17.6 62.1,17.6 55.79,23.91 31.82,23.91 31.52,23.6 v29.8,23.6
  Bottom 0.5: v85,11 84.55,11 | v32.53,42.29 29.94,42.29 v29.42,41.77 | 70.1,17.6 68.9,17.6
N$1
  Top 0.305: C0018.2 66.41,63.5 A4982_Y1.2
N$2
  Bottom 0.5: JP17.3 3.42,34.05 R0015.2
N$3  (via drill 0.4)
  Top 0.34: 97.4,12.4 97.4,12.18 94.44,9.21 90.04,9.21 89.3,8.48 85.18,8.48 84.3,7.6 v84.3,6.4
  Top 0.406: v68.2,15.1 67.42,15.1 R0029.1
  Top 0.5: JP24.5 97.4,17.63 97.4,12.4
  Bottom 0.3: v84.3,6.4 83.6,5.7 77.6,5.7
  Bottom 0.406: 77.6,5.7 v68.2,15.1
N$4  (via drill 0.4)
  Top 0.34: v88.5,53.3 88.8,53.3 89.28,52.82 90.34,52.82 R0023.1
  Bottom 0.3: 76.76,53.79 78,53.79 79.1,54.9 83.08,54.9 85.2,52.77
  Bottom 0.406: R0046.2 56.68,61.42 65.1,53 71.3,53 72.6,54.3 72.97,54.3 73.47,54.8 75.75,54.8 76.76,53.79 | 85.2,52.77 87.97,52.77 v88.5,53.3
N$5
  Top 0.47: U12.1 36.19,86.54 C0003.1
N$6  (via drill 0.4)
  Top 0.5: v12.5,13.8 12.5,7.55 JP2.2
  Bottom 0.5: R0024.1 16.51,15.31 15,13.8 v12.5,13.8
N$7
  Top 0.34: A4982_Y.12 91.3,64.61 92.22,63.69 92.22,59.91 | 93.68,52.62 94.25,53.19 94.25,53.35 94.53,53.63 95.75,53.63 C0010.1
  Top 0.406: 92.22,59.91 93.63,58.5 94.5,58.5 95.49,57.51 95.49,55.27 95.5,55.26 95.5,53.88 C0010.1 | R0023.2 93.68,52.62
N$8
  Top 0.34: C0002.2 83.77,63.53 84.19,63.95 A4982_Y.2
N$9
  Top 0.34: 83.07,64.61 A4982_Y.1
  Top 0.406: 82.43,63.97 83.07,64.61
  Top 0.5: 82.43,63.97 82.43,63.21 C0002.1
N$10
  Top 0.34: A4982_Y.3 84.83,62.58 84.83,62.57 84.83,61.35 C0006.1
N$11  (via drill 0.4)
  Top 0.3: v16.67,42.28 17.32,42.93 17.32,44.12 17.94,44.74 18.84,44.74 18.86,44.76 19.36,44.76 19.96,45.36 19.96,46.86 20.41,47.3 21.8,47.3 22.6,48.1
  Top 0.406: v13.9,25.66 15.3,27.06 v15.3,31.7 | 22.6,48.1 22.6,50.5
  Top 0.47: 22.6,50.5 22.86,50.76 v22.86,51.1
  Bottom 0.406: JP19.2 9.11,22.72 10.38,24 10.6,24 12.4,25.8 13.76,25.8 v13.9,25.66 | R0003.2 28.77,52.76 27.67,52.76 27.29,52.38 24.14,52.38 23.38,51.62
  Bottom 0.47: 23.38,51.62 v22.86,51.1
  Bottom 0.5: v15.3,31.7 15.3,40.91 v16.67,42.28
N$12
  Top 0.3: 85.48,63.57 85.48,63.27 C0004.1
  Top 0.34: A4982_Y.4 85.48,63.57
N$13  (via drill 0.4)
  Top 0.34: 74.8,64.61 A4982_Y1.12
  Top 0.4: v76.31,62.83 76.08,62.83 74.8,64.11 C0013.1
  Top 0.406: v74.98,58.54 74.85,58.41 74.85,51.4 R0037.2 | C0013.1 74.8,64.61
  Bottom 0.4: v76.31,62.83 76.31,60.42 74.98,59.08 v74.98,58.54
N$14
  Top 0.305: A4982_Y1.1 64.14,62.99 C0018.1
N$15  (via drill 0.4)
  Top 0.3: 88.38,77.18 v88.4,77.2 | v88.4,89.6 88.38,89.58
  Top 0.34: A4982_Y.18 87.44,72.28 87.42,72.3 87.42,73.92 87.62,74.12 87.62,74.87 88.08,75.33
  Top 0.406: 88.08,75.33 88.08,76.12 88.38,76.42 88.38,77.18
  Top 0.5: 88.38,89.58 88.38,91.38 90,93 90,95.08 X22.2
  Bottom 0.508: v88.4,89.6 v88.4,77.2
N$16
  Top 0.34: A4982_Y.15 89.39,71.2 90.97,72.78 90.97,75.12
  Top 0.5: 93.77,77.92 93.77,92.27 94.61,93.11 X22.1
  Top 0.61: 90.97,75.12 93.77,77.92
N$17
  Top 0.34: A4982_Y.19 86.78,74.19 86.98,74.39 86.98,75.66
  Top 0.5: 86.98,84.55 86.98,90.52 84.61,92.89 X22.3
  Top 0.75: 86.98,75.66 86.98,84.55
N$18
  Top 0.305: 84.83,71.27 84.17,71.93
  Top 0.34: A4982_Y.22 84.83,71.27
  Top 0.406: 81.12,73.03 82.22,71.93 84.17,71.93
  Top 0.5: 81.12,73.03 81.12,80.38 79.61,81.89 X22.4
N$19
  Top 0.3: 90.6,79.78 R0049.1
  Top 0.34: A4982_Y.17 88.08,73.2 88.51,73.63 88.51,74.52
  Top 0.508: 88.51,74.52 90.6,76.61
  Top 1.016: 90.6,76.61 90.6,79.78
N$20
  Top 0.305: 86.12,70.46 86.12,74.57
  Top 0.34: A4982_Y.20 86.12,70.46 | 86.12,74.57 85.82,74.88 85.84,74.9 85.78,74.96
  Top 0.61: 85.78,74.96 85.78,75.46
  Top 0.813: 85.78,75.46 84.54,76.7 | 84.54,77.79 arc-90 84.33,78
  Top 1.016: 84.33,78 R0051.1
  Top 1.27: 84.54,76.7 84.54,77.79
N$21
  Top 0.34: A4982_Y.8 88.08,61.93 89.78,60.23 89.78,57.56 R0006.2
N$22
  Top 0.305: A4982_Y.23 84.21,70.43 84.21,69.42
  Top 0.34: 81.41,71.65 79.84,73.22 R0009.2
  Top 0.406: 84.21,69.42 84.21,69.41 81.3,69.41 81.3,71.54 81.41,71.65
N$23
  Top 0.5: R0001.2 30.78,62.68 28.98,64.48 26.62,64.48 25.26,65.84 24.64,65.84 24.61,65.87 H_X.3
N$24
  Top 0.34: A4982_Y.14 90.03,69.21 92.49,69.21
  Top 0.406: 92.49,69.21 92.49,65.71 96.9,61.3 R0011.1
N$25
  Top 0.305: C0019.1 68.24,62.27 67.7,62.8 A4982_Y1.4
N$26
  Top 0.34: A4982_Y1.15 71.61,69.4 74.44,69.4 75.35,70.31 75.35,70.68 74.95,71.08
  Top 0.5: 75.68,75.15 75.68,94.08 X1.1
  Top 0.508: 74.95,71.08 74.95,74.42 75.68,75.15
N$27
  Top 0.47: R0016.1 18.55,57.35 R0043.2
  Top 0.75: JP23.1 14.6,57.45 R0016.1
N$28
  Top 0.813: 7.92,85.91 4.26,89.57 J1.3
  Top 1.016: 6.55,84.55 7.92,85.91 8.27,86.26
  Top 1.27: 8.27,86.26 17.14,86.26 18.84,87.96 X2.2 18.84,92.99 20.25,94.95 D12.2
  Top 2.54: J1.2 6.55,84.55
N$29
  Top 0.75: 51.3,73.89 50.83,73.42 COUT1.+ 44.44,77.23 C0023.1
  Top 1.27: TEST_R.1 52.99,75.58 51.3,73.89
  pour Top: 37,77.9 39.5,77.9 39.5,76.5 35.5,76.5 33.5,78.5 25.5,78.5 25.5,82.5 31.5,82.5 32,83 38,83 38,81 37,81
N$30  (via drill 0.4)
  Top 0.3: 69,76.84 68.97,76.88 v68.97,77.14 v68.98,77.14
  Top 0.34: A4982_Y1.19 69,76.84
  Top 0.5: X1.3 64.29,92.21 v68.69,87.81
  Bottom 0.3: v68.98,77.14 68.98,87.52 v68.69,87.81
N$31
  pour Top: 38.35,92.31 37.84,92.81 26.15,92.81 26.15,90.53 26.28,90.4 29.07,90.4 31.36,88.11 38.35,88.11
N$32  (via drill 0.4)
  Top 0.305: 1.27,5.33 1.22,5.38 1.22,7.18
  Top 0.406: 1.22,7.18 1.27,7.22 | 30,1.6 5,1.6 1.27,5.33
  Top 0.5: JP9.2 2.31,8.74 1.27,7.7 1.27,7.22 | 30,1.6 34.5,6.1 v34.5,11.4 | v32.7,14.9 32.7,16.9 43.44,27.64 R0031.1
  Bottom 0.5: v34.5,11.4 32.7,13.2 v32.7,14.9
N$33
  Top 0.5: JP24.3 96.26,23.57 94.37,21.67 94.37,17.95 94.4,17.91 94.4,14.73 R0002.2
N$34  (via drill 0.4)
  Top 0.5: R0005.2 48.2,49.47 v48.2,52.4
  Bottom 0.5: JP25.3 47.96,54.44 48,54.4 48,52.6 v48.2,52.4
N$35  (via drill 0.4)
  Top 0.3: 25.91,34.06 24.91,34.06 v24.76,34.21
  Top 0.5: R0043.1 25.91,51.69 25.91,34.06 25.91,33.26 R0017.1 | v36.5,22.6 36.5,33.7 v35.9,34.3
  Bottom 0.32: 87.2,4.07 92.94,4.07
  Bottom 0.34: 86.58,3.48 87.17,4.07 87.2,4.07
  Bottom 0.406: 92.94,4.07 93.67,4.8 93.8,4.8
  Bottom 0.47: 83.2,3.97 77.93,3.97 | 86.58,3.48 83.2,3.48
  Bottom 0.5: R0044.2 93.8,13.62 93.8,4.8 | 68.7,13.2 77.93,3.97 | v36.5,22.6 36.6,22.6 45.04,14.16 65.1,14.16 | v35.9,34.3 35.52,33.92 25.05,33.92 v24.76,34.21
  Bottom 0.508: 83.2,3.48 83.2,3.97
  Bottom 0.75: 65.1,14.16 65.7,13.2 68.7,13.2
N$36
  Bottom 0.5: JP8.2 94.23,35.57 92.42,37.38 R0053.1
N$37  (via drill 0.4)
  Top 0.305: A4982_Y1.22 67.06,71.33 66.93,71.46 65.05,71.46
  Top 0.406: v61.35,74.4 60.18,74.4
  Top 0.5: X1.4 59,95.18 59,84.17 57.95,83.11 57.95,76.64 60.18,74.4
  Top 0.508: 65.05,71.46 63.36,73.14 63.36,75.23 v63.53,75.4
  Bottom 0.406: v63.53,75.4 62.94,76 61.74,76 61.35,75.6 v61.35,74.4
N$38
  Top 0.5: JP11.2 2.51,54.91 Q1.2
N$39
  Top 0.305: 71.11,72.71 70.28,71.88 70.31,70.55 A4982_Y1.17
  Top 0.61: 71.11,72.71 71.11,75.66 71.1,75.67 72.12,76.69 72.12,76.8
  Top 0.813: R0052.1 72.12,76.8
N$40
  Top 0.5: R0025.2 11.26,47.6 9.52,47.6 JP6.2
N$41
  Bottom 0.5: R0026.2 12.91,22.24 JP13.2
N$42
  Top 0.3: 68.36,72.91 68.36,75.52 | 66.34,79.28 R0048.1
  Top 0.305: A4982_Y1.20 68.36,72.91
  Top 0.508: 68.36,75.52 66.34,77.53
  Top 0.813: 66.34,77.53 66.34,79.28
N$43  (via drill 0.4)
  Top 0.305: A4982_Y1.8 70.31,63.95 70.4,63.86 70.4,62.65 v70.6,62.45 | 70.73,58.3 71.12,58.69 v70.93,58.89
  Top 0.406: R0019.2 70.73,57.16 70.73,58.3
  Bottom 0.305: v70.6,62.45 70.6,60.16 70.93,59.84 v70.93,58.89
N$44
  Top 0.305: 66.41,69.1 A4982_Y1.23
  Top 0.508: 62.09,79.6 61.59,79.1 61.59,75.67 62.44,74.82 62.44,73.49 62.47,72.22 63.44,70.45 63.44,69.1 66.41,69.1
  Top 0.75: R0034.2 62.09,79.6
N$45
  Top 0.5: R0061.2 24.05,62.5 H_X.1
N$46
  Top 0.5: H_X.12 14.25,62.34 R0062.2
N$47  (via drill 0.4)
  Top 0.406: H_X.5 22.17,67.87
  Top 0.5: 22.17,67.87 v22.1,67.8
  Top 0.508: v22.1,67.8 22.2,67.9 22.2,71.52 C0007.1
  Bottom 0.5: v22.1,67.8 8.48,67.8 X27.2
N$48  (via drill 0.4)
  Top 0.5: v98.5,44.3 98.5,45.1 98.48,45.12 R0030.1
  Bottom 0.5: JP5.1 7.61,14.45 7.33,14.45 5.9,13.02 5.9,4 9.13,0.77 94.77,0.77 98.93,4.93 98.93,18.47 98.9,18.5 98.9,43.9 v98.5,44.3
N$49  (via drill 0.4)
  Top 0.34: A4982_Y1.14 72.25,71.21 73.05,72
  Top 0.406: 73.05,72 73.42,72 73.7,72.28 v73.7,74.5 | v78.8,73.1 78.9,73 78.9,69.84 R0036.1
  Bottom 0.406: v73.7,74.5 76.6,74.5 78,73.1 v78.8,73.1
N$50  (via drill 0.4)
  Top 0.5: JP25.5 53.04,60.06 60.9,52.2 60.9,43.8 53.6,36.5 53.6,34 41.9,22.3 v41.5,22.3
  Bottom 0.3: R0032.1 83.64,7.58 82.58,6.52 78.78,6.52 69.1,16.2
  Bottom 0.5: v41.5,22.3 54.6,22.3 60.7,16.2 69.1,16.2
N$51  (via drill 0.4)
  Top 0.406: v65.5,21.5 63.24,21.5 R0033.2
  Bottom 0.3: 87.26,15.89 83.1,11.73 77.87,11.73 77.81,11.79
  Bottom 0.34: JP10.3 87.26,15.89
  Bottom 0.406: 77.81,11.79 77.21,11.79 70.5,18.5 70.5,18.8 67.8,21.5 v65.5,21.5
N$52
  Bottom 0.5: R0042.2 7.02,50.22 6.34,49.54 6.34,46.64 4.54,44.84 JP14.2
N$53  (via drill 0.4)
  Top 0.3: 84.26,27.1 83.8,27.1 v83.8,26.98
  Top 0.305: 67.1,31.5 59.7,31.5
  Top 0.406: v70.2,28.4 67.1,31.5 | 59.7,31.5 58.94,30.74 R0008.2
  Top 0.5: JP1.1 85.76,28.32 85.48,28.32 84.26,27.1 | R0008.2 58.85,29.5 v56.5,29.5 | v46.9,29.6 46.9,30.1 48.9,32.1 v48.9,32.5
  Bottom 0.3: v83.8,26.98 72.72,26.98
  Bottom 0.406: 72.2,27.5 71.3,28.4 v70.2,28.4
  Bottom 0.5: 72.72,26.98 72.2,27.5 | v56.5,29.5 47,29.5 v46.9,29.6 | v48.9,32.5 48.21,33.19 R0020.2
N$54  (via drill 0.4)
  Top 0.3: 70.28,94.48 69.98,94.78
  Top 0.34: A4982_Y1.18 69.66,72.94 70.09,73.37 70.09,76.15 70.6,76.66 v70.6,77.12
  Top 0.406: v70.28,89.68 70.28,94.48
  Top 0.5: 70.35,94.41 69.98,94.78 X1.2
  Bottom 0.3: v70.6,77.12 70.6,89.36 v70.28,89.68
N$55
  Top 0.305: C0021.1 66.45,60.84 67.06,61.45 A4982_Y1.3
N$56
  Bottom 0.3: STM.L5 82.54,13 85.09,15.54
  Bottom 0.5: 85.09,15.54 85.09,16.64 85.84,17.4 88.9,17.4 91.19,19.69 JP12.2
N$57  (via drill 0.4)
  Top 0.3: 84.81,49.4 82.69,47.27 79.09,47.27 78.32,46.5 77.6,46.5
  Top 0.34: R0045.2 96.8,68.41 96.8,64.59 98.12,63.27 | 98.12,54.82 98.2,54.75 98.2,50.3 97.26,49.37 v97.2,49.37
  Top 0.406: 98.12,63.27 98.12,54.82 | v86.9,49.4 84.81,49.4
  Top 0.5: R0037.1 76.7,47.43 76.7,47.4 77.6,46.5
  Bottom 0.406: v97.2,49.37 96.8,48.97 87.33,48.97 v86.9,49.4
N$58  (via drill 0.4)
  Top 0.5: JP12.1 91.19,30.4 90.09,31.51 90.09,35.13 90.35,35.4 90.35,36.32 89.27,37.4 88.3,37.4 v88,37.1
  Bottom 0.3: STM.L24 80.26,35.86 81.51,37.11 87.99,37.11 v88,37.1
N$59  (via drill 0.4)
  Top 0.406: R0027.2 49.7,40.84 49.7,33.6 v50.1,33.2 | v62.4,32.6 67.9,32.6 71.6,28.9 71.6,26.3 71.4,26.1 v71.45,26.05
  Bottom 0.3: STM.L6 78,13 74.52,16.48
  Bottom 0.406: 71.5,20.2 71.5,25.1 71.45,25.15 v71.45,26.05 | v50.1,33.2 50.9,33.2 51.7,32.4 62.2,32.4 v62.4,32.6
  Bottom 0.5: 71.5,20.2 71.5,18.82 73.85,16.48 74.52,16.48
N$60  (via drill 0.4)
  Top 0.406: R0018.2 86.42,39.01 86.42,38.55 86,38.13 86,35.7 85.8,35.5 v85.8,35.1 | JP21.2 91.72,5.34 97.08,10.7 v97.7,10.7 | v92.8,29.4 92.8,32 92.5,32.3 v92.4,32.3
  Bottom 0.406: v97.7,10.7 96.6,11.8 96.6,15.6 93.31,18.89 93.31,22.09 93.15,22.25 93.15,23.01 93.44,23.3 93.44,24.5 93.17,24.77 93.17,25.39 93.41,25.62 93.41,26.57 92.8,27.18 v92.8,29.4 | v92.4,32.3 91,33.7 87.1,33.7 85.8,35 v85.8,35.1
N$114
  Top 0.5: H_X.11 11.89,64.87 R0063.2
N$118
  Top 0.5: H_X.7 14.14,68.98 C0008.1 4.66,68.98 X27.1
N§VV  (via drill 0.4)
  Top 0.47: TEST_R2.1 40.38,80.84 TEST_R3.1 41.98,80.5 44.5,80.5 46.5,78.5 v46.5,77.6 | v45.4,67.8 50.5,62.7 JP25.4
  Top 0.5: v58,33.5 58.3,33.8 63.42,33.8 63.71,34.09 67.81,34.09 v72.6,29.3 | v51.6,34.3 51.6,38.5 56.2,43.1 57.8,43.1 58.8,44.1 58.8,50.5 50.5,58.8 JP25.4
  Top 0.75: U12.4 41.9,81.09 TEST_R3.1
  Bottom 0.3: 73.73,29.52 82.67,29.52 83.87,28.6 84.7,28.6
  Bottom 0.406: 84.7,30.16 85.57,31.03 85.68,31.03 85.69,31.04
  Bottom 0.47: v45.4,67.8 45,68.2 45,75 46.5,76.5 v46.5,77.6 | 84.7,28.6 84.7,30.16
  Bottom 0.5: 73.73,29.52 73.5,29.3 v72.6,29.3 | v58,33.5 52.4,33.5 v51.6,34.3 | 85.69,31.04 93.04,31.04 94.26,29.82 94.26,24.91 94.27,24.92 94.27,21.53 94.77,21.03 JP24.4
PWM-H  (via drill 0.4)
  Top 0.47: R0062.1 14.63,60.26 20.94,60.26 24.9,56.3 34.9,56.3 v36.2,57.6
  Bottom 0.3: STM.L38 79.04,53.64 77.7,52.3
  Bottom 0.47: 38.1,57.4 37.9,57.6 v36.2,57.6
  Bottom 0.5: 77.7,52.3 72.5,52.3 71.9,51.7 71.9,51.2 42.91,51.2 38.77,55.33 38.77,56.73 38.1,57.4
RESET1_Z  (via drill 0.4)
  Top 0.3: 22.71,7.92 STM.R1 | v69.34,63.31 69.56,63.52
  Top 0.305: A4982_Y1.7 69.61,64.57 69.61,63.93 69.56,63.88 69.56,63.52 | R0038.2 69.33,57.13 v69.33,58.64
  Top 0.406: R0038.2 69.09,55.49 69.15,55.49 69.7,54.94 69.7,50.8
  Top 0.5: 22.71,7.92 25.19,10.39 30.46,10.39 40.79,20.72 41.67,20.72 49.92,28.97 50.58,28.97 63.72,42.11 63.72,44.68 64.51,45.47 64.68,45.47 69.7,50.49 69.7,50.8
  Bottom 0.305: v69.34,63.31 69.33,63.3 v69.33,58.64
RESET2_Y  (via drill 0.4)
  Top 0.3: 87.87,47.27 82.81,42.21 81.47,42.21 80.92,41.66 80.92,40.35 80.25,39.67 78.87,39.67 78.2,39.01 78.2,34.9 v78.1,34.8
  Top 0.305: 87.33,50.4 87.87,49.86
  Top 0.34: A4982_Y.7 87.44,61.24 87.47,61.2 | 85.63,55.93 85.3,55.93 84.2,54.84 84.2,52.4 86.2,50.4 87.33,50.4 | 87.87,49.86 87.87,47.27
  Top 0.406: R0021.2 86.68,56.98 85.63,55.93
  Top 0.5: 87.47,61.2 87.47,59 86.88,58.41 R0021.2
  Bottom 0.3: v78.1,34.8 78.32,34.58 80.92,34.58 STM.L21
SCL
  Bottom 0.3: STM.R3 20.54,10.46 19.29,9.21 18.06,9.21 16.81,10.46 8.98,10.46
  Bottom 0.5: 8.98,10.46 JP5.3
SDA
  Bottom 0.3: STM.R5 20.54,13 19.28,11.74 17.98,11.74 17.07,12.65 9.33,12.65
  Bottom 0.5: 9.33,12.65 JP5.2
SLEEP1_Z  (via drill 0.4)
  Top 0.3: R0039.2 78.33,57.37 78.33,54.67 76.36,52.7 76.36,49.23 76.41,49.18 77.27,48.32 v77.33,48.32
  Top 0.305: A4982_Y1.9 70.98,64.64 70.98,65.28 71.36,65.66 74.91,65.66 v75.51,66.26 | 77.45,58.85 v77.45,60.84
  Top 0.406: R0039.2 77.15,58.85 77.45,58.85
  Bottom 0.3: v77.33,48.32 77.2,48.32 74.64,45.75 74.64,44.77 | STM.R23 21.22,36.09 22.21,37.08 45.6,37.08
  Bottom 0.305: v75.51,66.26 75.68,66.26 77.46,64.48 v77.46,60.83 v77.45,60.84
  Bottom 0.47: 60.5,37.08 61.08,36.5 66.36,36.5 72.43,42.57 | 45.6,37.08 46,36.68 46,36.5 46.3,36.2 48.92,36.2 49.8,37.08 | 72.43,43.93 73.29,44.79 73.3,44.77 74.64,44.77
  Bottom 0.5: 49.8,37.08 60.5,37.08
  Bottom 0.75: 72.43,42.57 72.43,43.93
SLEEP2_Y  (via drill 0.4)
  Top 0.3: STM.L4 79.64,10.56 80.93,11.85 80.93,39.16 81.45,39.69 83.06,39.69
  Top 0.305: R0022.2 v88.86,50.12
  Top 0.34: A4982_Y.9 88.73,62.73 v89.78,61.69
  Top 0.406: 83.06,39.69 83.9,40.53
  Top 0.47: 83.9,40.53 83.9,41.3 84.3,41.7
  Top 0.5: v88.86,50.12 88.96,50.02 88.96,46.86 84.3,42.2 84.3,41.7
  Bottom 0.406: v89.78,61.69 89.78,55.28 89.5,55 89.5,53.68 89.91,53.27 89.91,52.52 89.1,51.72 89.1,51.6 88.86,51.36 v88.86,50.12
SO  (via drill 0.4)
  Top 0.5: v32.7,64.9 32.7,64.6 32.38,64.28 32.38,60.98 31.38,59.98 R0001.1
  Bottom 0.3: 77.79,51.39 78.78,52.38 80.48,52.38 81.54,53.44 81.88,53.44 81.98,53.54 81.98,53.64 STM.L37
  Bottom 0.5: v32.7,64.9 32.7,59 41.9,49.8 74.44,49.8 76.03,51.39 77.79,51.39
STEP1_Z
  Top 0.3: STM.R4 19.93,9.21 19.93,6.87 21.7,5.1
  Top 0.406: R0035.1 72.1,53.28 72.1,50.9
  Top 0.5: 72.1,50.9 65.87,44.67 64.84,44.67 64.52,44.35 64.52,41.78 55.25,32.51 55.25,30.08 53.34,28.17 50.25,28.17 42,19.92 41.42,19.92 29.02,7.52 29.07,7.48 29.07,4.48 27.45,2.86 25.15,2.86 22.92,5.1 21.7,5.1
STEP2_Y  (via drill 0.4)
  Top 0.5: R0010.1 93.78,54.28 v93.4,53.9 | v91.7,51.2 91.7,48.3 v90.3,46.9 | v75.9,37.2 64.85,37.2 63.07,35.42 59.92,35.42 v59.9,35.4
  Bottom 0.3: v75.9,37.2 75.96,37.14 80.27,37.14 80.93,37.8 80.93,39.17 81.44,39.68 88.03,39.68 | 29.7,35.4 22.53,35.4 21.74,34.61 20.67,34.61 19.93,35.35 19.93,39.65 STM.R27
  Bottom 0.5: v93.4,53.9 93.2,53.9 91.7,52.4 v91.7,51.2 | v59.9,35.4 29.7,35.4 29.36,35.4 | 88.03,39.68 90.5,42.15 90.5,46.7 v90.3,46.9
STP1
  Top 0.34: A4982_Y.11 90.03,63.84 91.47,62.41 91.47,59.33
  Top 0.5: R0010.2 93.58,57.22 91.47,59.33
STP2  (via drill 0.4)
  Top 0.305: A4982_Y1.11 72.25,63.94 72.61,63.59 | R0035.2 74.11,56.99 74.11,57.8
  Top 0.34: 72.61,63.59 73.65,63.59 v74.79,62.45
  Top 0.4: v73.61,58.64 73.61,58.3 74.11,57.8
  Bottom 0.305: 73.61,59.11 74.73,60.23 74.73,62.39
  Bottom 0.4: 74.73,62.39 v74.79,62.45 | v73.61,58.64 73.61,59.11
TASTER1_START  (via drill 0.4)
  Top 0.3: STM.R16 17.58,24.6 17.07,24.6 v16.85,24.38
  Bottom 0.3: v16.85,24.38 15.5,25.73
  Bottom 0.34: 12.04,26.96 11.23,26.96 JP7.1
  Bottom 0.5: 12.04,26.96 R0012.2 14.24,26.96 15.5,26.6 15.5,25.73
TASTER2_STOP
  Top 0.5: JP3.1 14.03,46.79 R0013.2
  Bottom 0.3: STM.R30 16.82,43.48 14.85,45.45
  Bottom 0.5: 14.85,45.45 JP3.1
TASTER3_PAUSE  (via drill 0.4)
  Top 0.3: 15.08,39.68 19.62,39.68 20.9,38.4 STM.R25
  Top 0.5: JP4.2 12.84,37.44 15.08,39.68 | v28.3,45.6 28.3,47.2 v29.8,48.7
  Bottom 0.3: STM.R25 24.54,41.72
  Bottom 0.5: 24.54,41.72 24.54,44.04 25.19,44.68 27.38,44.68 v28.3,45.6 | v29.8,48.7 30.5,48.7 33.24,45.95 R0014.2
TEMP-µ  (via drill 0.4)
  Top 0.3: STM.R26 17.7,38.4 15.44,35.59 | v22.83,34.22 22.83,34.24 22.49,34.58 16.45,34.58
  Top 0.5: C0011.1 15.44,35.59 16.45,34.58
  Bottom 0.3: 25.18,33.16 23.87,33.16 23.34,33.69 23.34,33.71 v22.83,34.22
  Bottom 0.406: 45.37,33.16 25.18,33.16
  Bottom 0.5: R0020.1 45.37,33.16
TEST-I-REGLER  (via drill 0.4)
  Top 0.3: STM.L30 78.4,42.24 73.55,42.24
  Top 0.5: v91.6,42.2 91.23,42.57 89.26,42.57 89.29,42.6 v89.33,42.6 | 73.55,42.24 73.31,42 71.68,42 C0025.2
  Bottom 0.3: STM.L30 80.93,42.19 83.29,42.19 83.68,42.58 89.21,42.58
  Bottom 0.5: R0053.2 91.6,41.36 v91.6,42.2 | v89.33,42.6 89.23,42.6 89.21,42.58
TEST-P-REGLER  (via drill 0.4)
  Top 0.3: STM.L32 79.24,45.62 77.28,45.62
  Top 0.5: 77.28,45.62 75.5,47.4 70.5,47.4 69.18,46.08 C0024.2 65.65,40.35 64.61,40.35 63.95,39.7 63.95,39.85 62.7,38.6 v62.7,37.8 | v47.4,38 45.32,38 R0031.2
  Bottom 0.5: v62.7,37.8 62.5,38 v47.4,38
TüR_SCHALTER  (via drill 0.4)
  Top 0.3: 23.37,29.5 19.92,29.5 18.68,28.26 STM.R18 18.64,28.24 15.9,25.5 | 23.33,19.37 17.97,19.37 17.38,19.96 17.38,21.52 17.1,21.8 17.1,22.67 15.4,24.37
  Top 0.5: R0017.2 23.37,29.5 | v40.8,10.7 43.31,8.19 76.21,8.19 81.6,2.8 JP21.1 | v23.6,19.1 23.33,19.37 | 15.4,24.37 15.4,25.03 15.87,25.5 15.9,25.5
  Bottom 0.5: v40.8,10.7 33.49,18.01 25.29,18.01 25.27,18 24.1,18 23.6,18.5 v23.6,19.1
µC  (1 unrouted)